# EAGLE design slo (EAGLE 9.6.2)
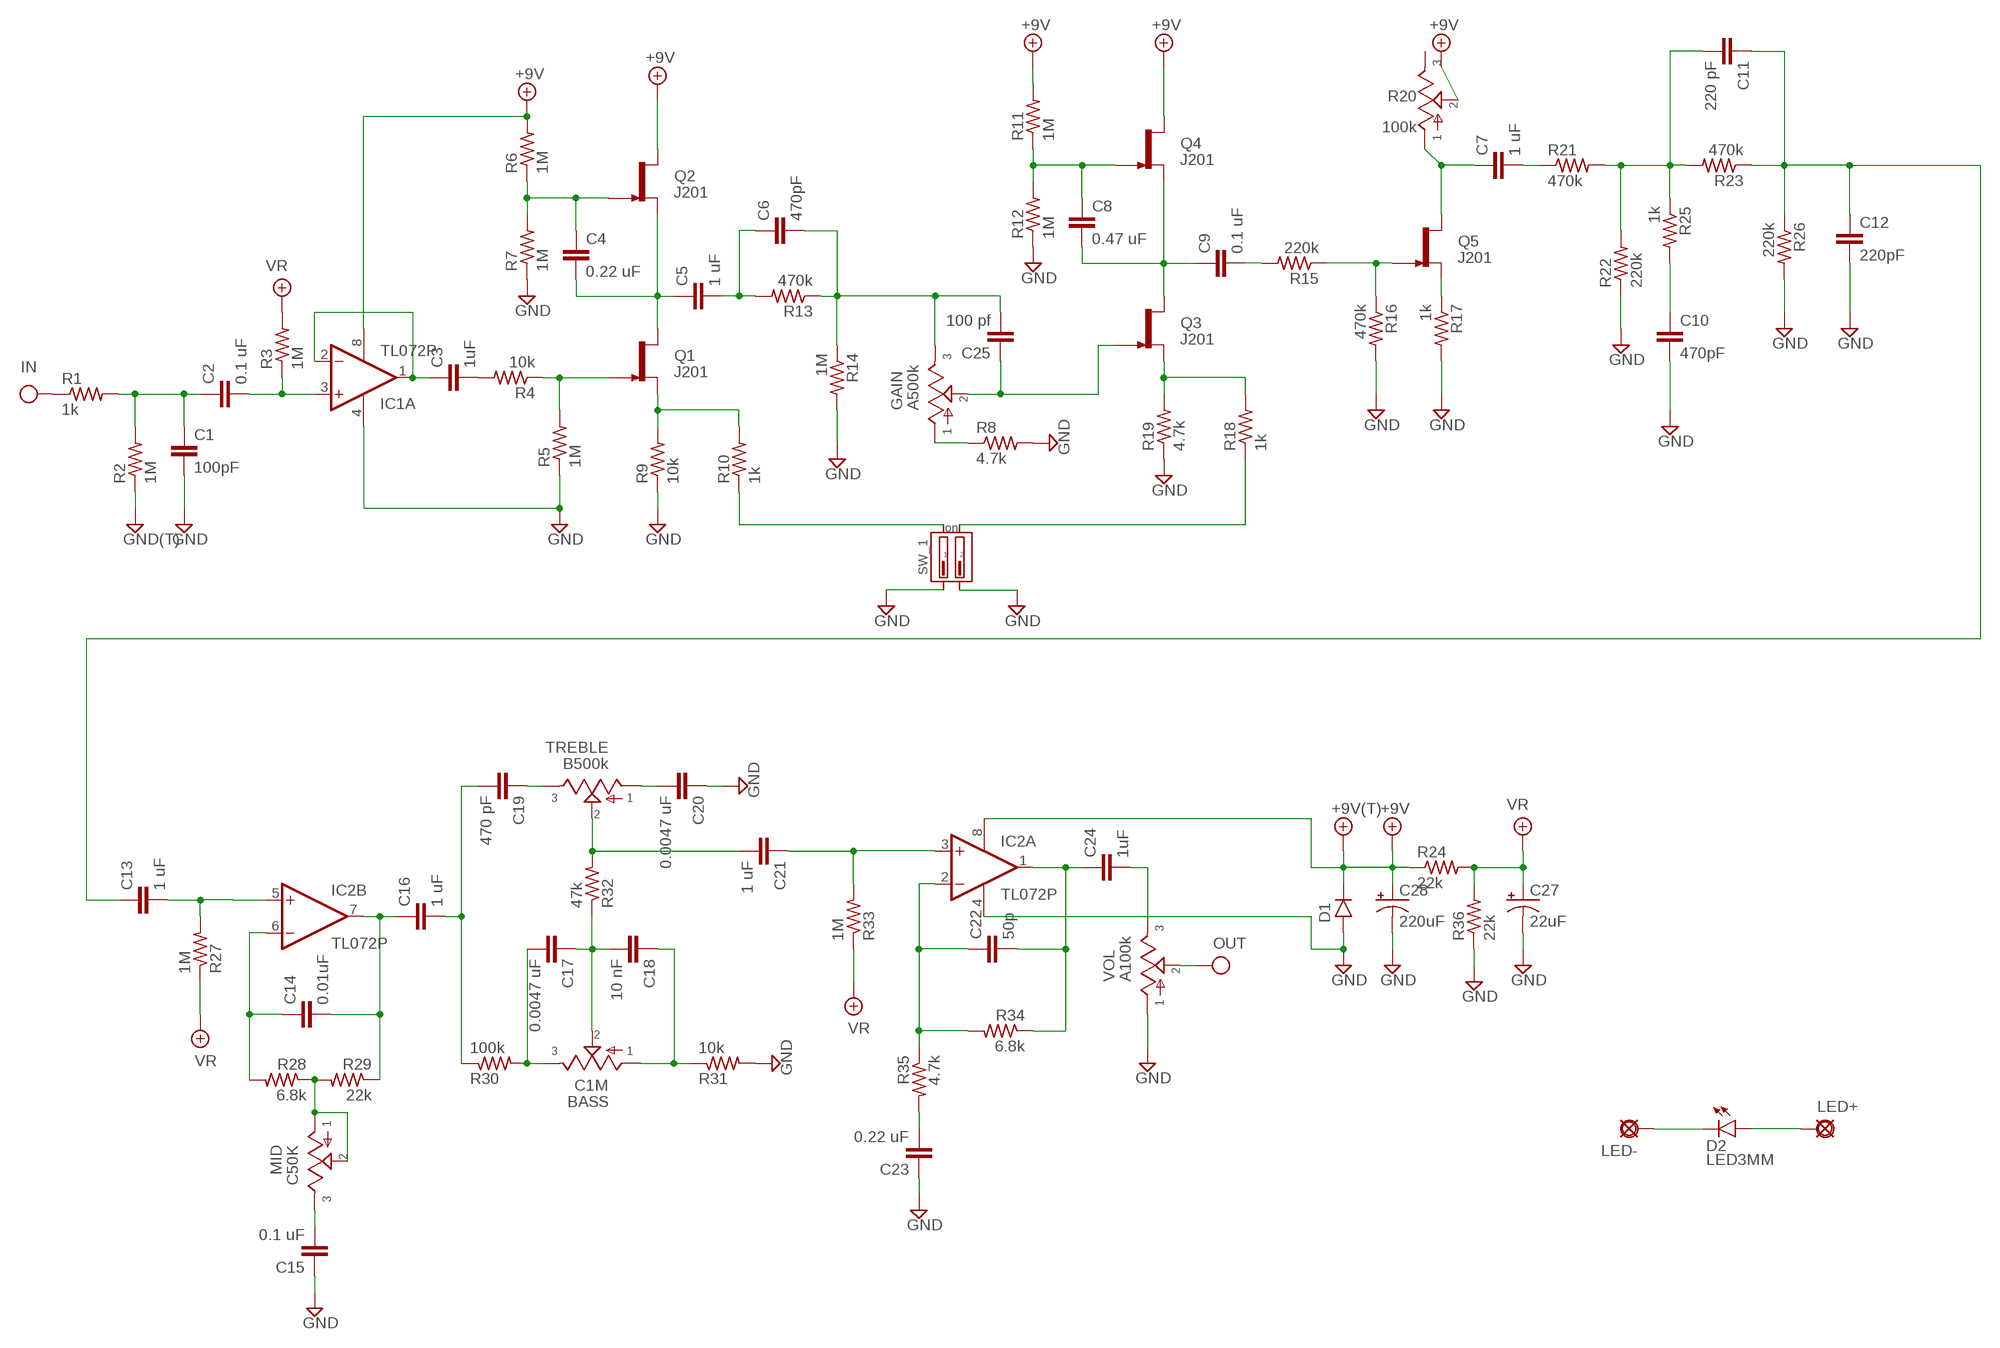
[diagram p0: schematic, sheet 1]

## Parts
+9V  +9V(T)  [SQUARE]
BASS  C1M  POT16MM  [16MM]
C1  100pF  050X030_0502  [050X030_050]
C2  0.1 uF  080X0452  [080X045]
C3  1uF  080X0502  [080X050]
C4  0.22 uF  080X0452  [080X045]
C5  1 uF  070X0302  [070X030]
C6  470pF  050X030_0502  [050X030_050]
C7  1 uF  080X0502  [080X050]
C8  0.47 uF  080X0452  [080X045]
C9  0.1 uF  080X0452  [080X045]
C10  470pF  070X0302  [070X030]
C11  220 pF  075X0353  [075X035_3]
C12  220pF  075X0353  [075X035_3]
C13  1 uF  080X0502  [080X050]
C14  0.01uF  050X030_0501  [050X030_050_1]
C15  0.1 uF  080X0453  [075X040_3]
C16  1 uF  080X0502  [080X050]
C17  0.0047 uF  075X0352  [075X035]
C18  10 nF  075X0352  [075X035]
C19  470 pF  075X0302  [075X030]
C20  0.0047 uF  075X0352  [075X035]
C21  1 uF  080X0502  [080X050]
C22  50p  050X030_0501  [050X030_050_1]
C23  0.22 uF  080X0452  [080X045]
C24  1uF  080X0502  [080X050]
C25  100 pf  050X030_0501  [050X030_050_1]
C27  22uF  050  [050_020]
C28  220uF  0631  [063_025]
D1  1N400X.1  [DO41-1]
D2  LED3MM  [LED3MM]
GAIN  A500k  POT16MM  [16MM]
GND  GND(T)  [SQUARE]
IC1  TL072P  [DIL08]
IC2  TL072P  [DIL08]
IN  IN(T)  [SQUARE]
LED+  PADO  [ROUND]
LED-  PAD  [SQUARE]
MID  C50K  POT16MM  [16MM]
OUT  OUT(T)  [SQUARE]
Q1  J201  [TO92-]
Q2  J201  [TO92-]
Q3  J201  [TO92-]
Q4  J201  [TO92-]
Q5  J201  [TO92-]
R1  1k  3MM.2  [R0204/2]
R2  1M  3MM.2  [R0204/2]
R3  1M  3MM.2  [R0204/2]
R4  10k  3MM.2  [R0204/2]
R5  1M  3MM.2  [R0204/2]
R6  1M  3MM.2  [R0204/2]
R7  1M  3MM.2  [R0204/2]
R8  4.7k  3MM.2  [R0204/2]
R9  10k  3MM.2  [R0204/2]
R10  1k  3MM.2  [R0204/2]
R11  1M  3MM.2  [R0204/2]
R12  1M  3MM.2  [R0204/2]
R13  470k  3MM.2  [R0204/2]
R14  1M  3MM.2  [R0204/2]
R15  220k  3MM.2  [R0204/2]
R16  470k  3MM.2  [R0204/2]
R17  1k  3MM.2  [R0204/2]
R18  1k  3MM.2  [R0204/2]
R19  4.7k  3MM.2  [R0204/2]
R20  100k  POTTRIM  [B25P]
R21  470k  3MM.2  [R0204/2]
R22  220k  3MM.2  [R0204/2]
R23  470k  3MM.2  [R0204/2]
R24  22k  3MM.2  [R0204/2]
R25  1k  3MM.2  [R0204/2]
R26  220k  3MM.2  [R0204/2]
R27  1M  3MM.2  [R0204/2]
R28  6.8k  3MM.2  [R0204/2]
R29  22k  3MM.2  [R0204/2]
R30  100k  3MM.2  [R0204/2]
R31  10k  3MM.2  [R0204/2]
R32  47k  3MM.2  [R0204/2]
R33  1M  3MM.2  [R0204/2]
R34  6.8k  3MM.2  [R0204/2]
R35  4.7k  3MM.2  [R0204/2]
R36  22k  3MM.2  [R0204/2]
SW_1  DIP2  [DIP2.B]
TREBLE  B500k  POT16MM  [16MM]
VOL  A100k  POT16MM  [16MM]

## Nets
+9V: +9V.1(+9V) C28.+ D1.C IC1.8(P:V+) IC2.8(P:V+) Q2.3(D) Q4.3(D) R6.2 R11.2 R20.2 R24.1
GND: C1.2 C10.2 C12.2 C15.1 C20.1 C23.1 C27.- C28.- D1.A GND.1(GND) IC1.4(P:V-) IC2.4(P:V-) R2.1 R5.1 R7.1 R8.2 R9.1 R12.1 R14.2 R16.2 R17.2 R19.1 R22.1 R26.2 R31.2 R36.1 SW_1.P$1 SW_1.P$3 VOL.1
IN: IN.1(IN) R1.1
N$1: C1.1 C2.1 R1.2 R2.2
N$2: C2.2 IC1.3(A:+IN) R3.1
N$3: C3.1 IC1.1(A:OUT) IC1.2(A:-IN)
N$4: C25.1 GAIN.2 Q3.1(G)
N$5: C3.2 R4.2
N$6: Q1.1(G) R4.1 R5.2
N$7: Q1.2(S) R9.2 R10.2
N$8: C5.2 C6.1 R13.2
N$9: Q5.1(G) R15.1 R16.1
N$10: C6.2 C25.2 GAIN.3 R13.1 R14.1
N$11: C10.1 R25.2
N$12: Q3.2(S) R18.2 R19.2
N$13: C4.2 C5.1 Q1.3(D) Q2.2(S)
N$14: GAIN.1 R8.1
N$15: C8.2 C9.1 Q3.3(D) Q4.2(S)
N$16: C4.1 Q2.1(G) R6.1 R7.2
N$17: C8.1 Q4.1(G) R11.1 R12.2
N$18: C9.2 R15.2
N$19: Q5.2(S) R17.1
N$20: C7.1 Q5.3(D) R20.1
N$21: C7.2 R21.1
N$22: C14.2 C16.1 IC2.7(B:OUT) R29.1
N$23: MID.1 MID.2 R28.1 R29.2
N$24: C14.1 IC2.6(B:-IN) R28.2
N$25: C16.2 C19.2 R30.1
N$26: C15.2 MID.3
N$27: C11.1 C12.1 C13.1 R23.1 R26.1
N$28: BASS.3 C17.2 R30.2
N$29: D2.K(C) LED-.1(PAD)
N$30: C13.2 IC2.5(B:+IN) R27.2
N$31: BASS.1 C18.1 R31.1
N$32: C11.2 R21.2 R22.2 R23.2 R25.1
N$33: BASS.2 C17.1 C18.2 R32.1
N$34: C19.1 TREBLE.3
N$35: C21.2 R32.2 TREBLE.2
N$36: C20.2 TREBLE.1
N$37: C21.1 IC2.3(A:+IN) R33.2
N$38: D2.A LED+.1(PAD)
N$39: C22.1 IC2.2(A:-IN) R34.2 R35.1
N$40: C22.2 C24.1 IC2.1(A:OUT) R34.1
N$41: C23.2 R35.2
N$42: R18.1 SW_1.P$4
N$43: C24.2 VOL.3
N$44: R10.1 SW_1.P$2
OUT: OUT.1(OUT) VOL.2
VR: C27.+ R3.2 R24.2 R27.1 R33.1 R36.2
Unconnected: IC1.5(B:+IN) IC1.6(B:-IN) IC1.7(B:OUT) R20.3

## Library data of the parts
+9V = gm-supply:+9V(T): +9V Voltage Supply use this to hook up +9v throughout a schematic instead of running wire automatically labels the net "+9v" adds a hookup pad to the circuit board
BASS GAIN MID R20 TREBLE VOL = gm-pots:POT: Potentiometers the arrow indicates the clockwise motion of th wiper (lug 2) fully counter clockwise there is no resistance between lugs 1 and 2 fully clockwise the resistance between lugs 1 and 2 is the value of the pot
C1 C6 C14 C22 C25 = gm-caps-ceramic:050X030_050: 120 - 150pF Xicon Ceramic Disc 5mm lead spacing
C2 C4 C8 C9 C15 C23 = gm-caps-film-chicklet:080X045: 0.056 - 0.082uF Panasonic ECQ-B 8mm x 4.5mm 50V: 0.056 - 0.082uF;
C3 C7 C13 C16 C21 C24 = gm-caps-film-chicklet:080X050: 0.1uF Panasonic ECQ-B 8mm x 5mm
C5 C10 = gm-caps-film-chicklet:070X030: 0.0001 - .01uF (100 - 10,000pF) Panasonic ECQ-B 7mm x 3mm 50 or 63V: 0.0001 - .01uF (100 - 10,000pF);
C11 C12 C17 C18 C20 = gm-caps-film-chicklet:075X035: 0.027 - 0.033uF Panasonic ECQ-B 7mm x 4mm 50 or 63V: 0.027 - 0.033uF;
C19 = gm-caps-film-chicklet:075X030: 0.015 - 0.022uF Panasonic ECQ-B 7.5mm x 3mm 50 or 63V: 0.015 - 0.022uF;
C27 = gm-caps-electro-pol:050: 0.22 - 100uF Xicon values at Mouser.com: 10V: 10 - 100uF; 16V: 2.2 - 47uF; 25V: 0.47 - 47uF; 50V: 0.22 - 22uF
C28 = gm-caps-electro-pol:063: 33 - 220uF Xicon values at Mouser.com 10V: 220uF; 16V: 100uF; 25V: 100uF; 50V: 33uF
D1 = gm-diodes:1N400X: Rectifier Diodes often used in power supply to prevent damage from reverse polarization
D2 = gm-diodes:LED
GND = gm-supply:GND(T): Ground use this to hook up ground (GND) throughout a schematic instead of running wire automatically labels the net "GND" adds a hookup pad to the circuit board (you can use several)
IC1 IC2 = gm-ics:TL072: OP AMP
IN = gm-supply:IN(T): Input obsolete: use Pad instead and label net shematic input label with circuit board terminal/pad generally used only once on a schematic (because this device labels the net "IN" in the same way as a voltage supply or ground net); SPICEPREFIX: I
LED+ LED- = gm-supply:PAD: PAD use this package for pads with any purpose, including input, output, send or return various pad shapes: round, square, octogonal, long, and long offset
OUT = gm-supply:OUT(T): Output obsolete: use Pad instead and label net output label with circuit board terminal/pad usually appears only once on a schematic
Q1-Q5 = gm-trans:J201: N-channel JFET
R1-R19 R21-R36 = gm-resistors:3MM: 3mm Resistors Leads spaced 1-6 holes apart for 0.1" perfboard. Suitable for 1/8 watt resistors.
SW_1 = switches:DIP2: DIP 2-position

## Board
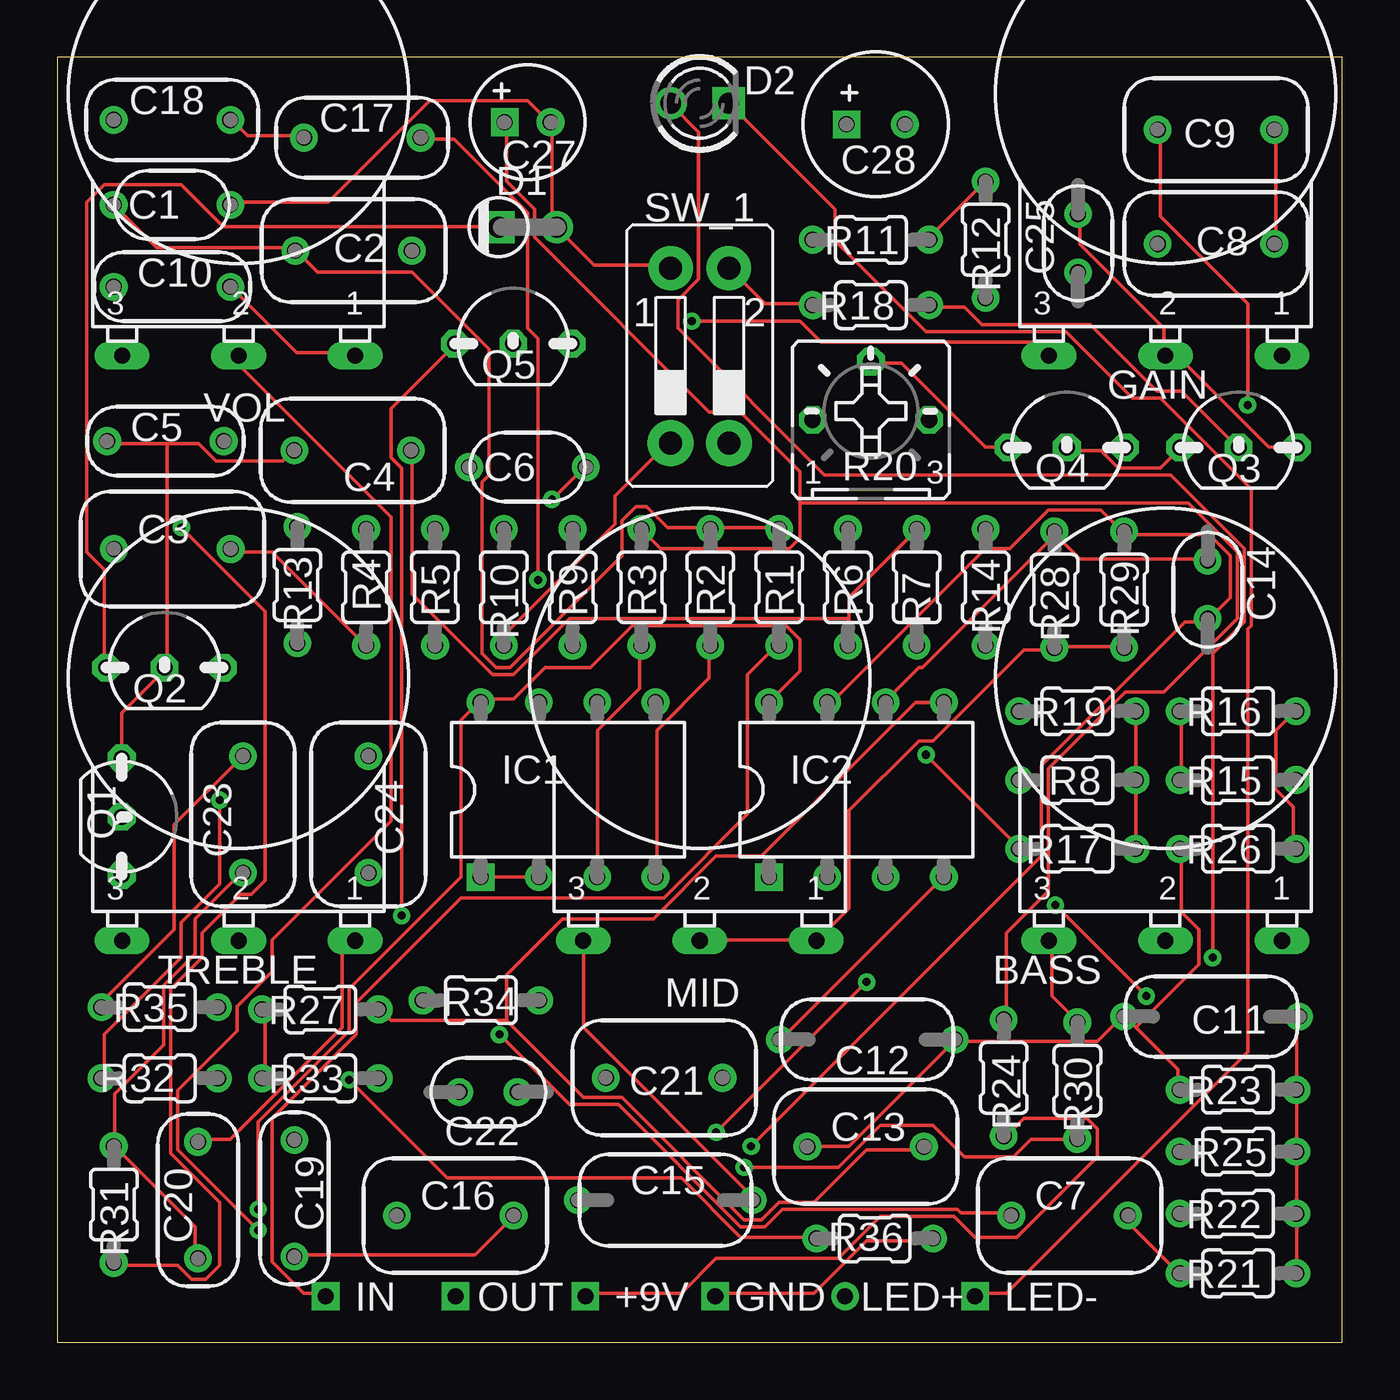
[diagram p1: board, top side]
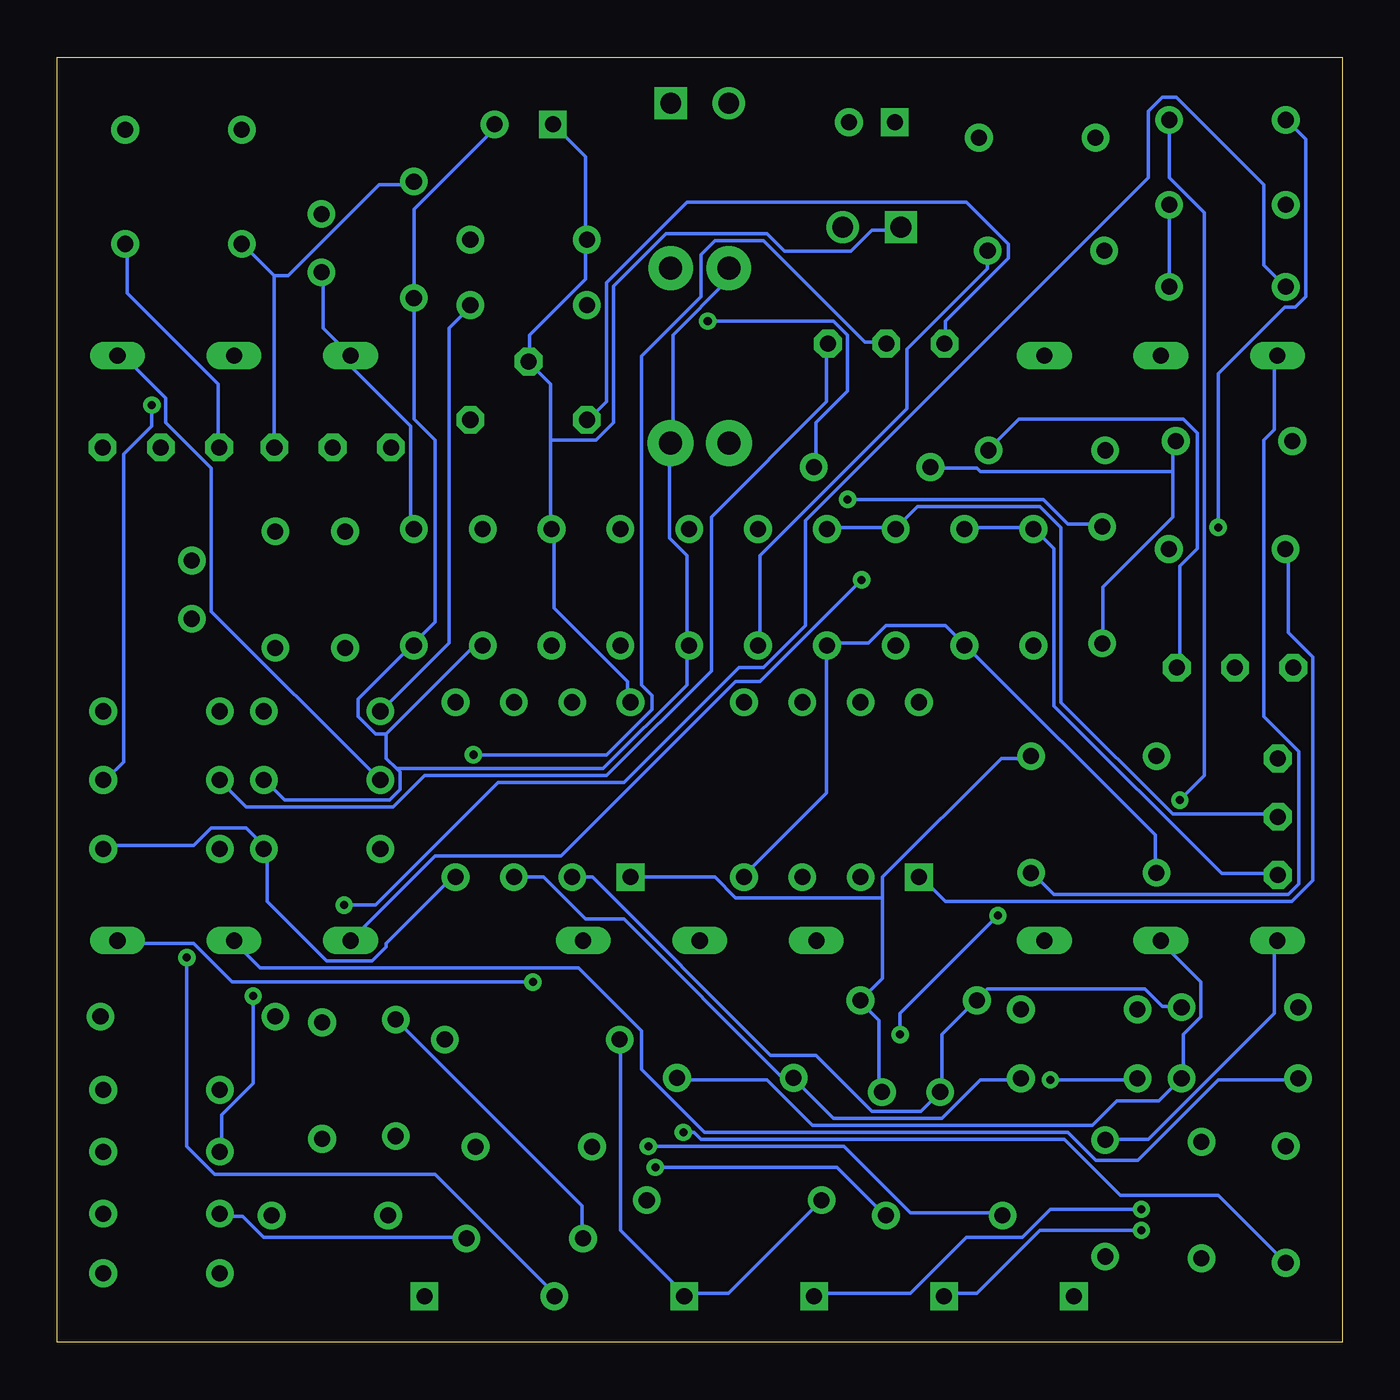
[diagram p2: board, bottom side, seen from below]

Size 56 x 56 mm. Coordinates in mm from the lower left corner, seen from the top.
Outline: 0,0 56,0 56,56 0,56 0,0
Copper layers (1*16): Top 0.035mm / dielectric 1.5mm / Bottom 0.035mm
Design rules "default": minimum track width 6mil, minimum drill 0.35mm, track to track 6mil, track to pad 6mil, pad to pad 6mil, via to via 6mil, smd to smd 6mil, copper to edge 40mil, drill to drill 6mil, minimum pad ring 10mil, minimum via ring 8mil, stop-mask expansion 4mil, vias tented up to drill 0mil, thermal gap 10mil

### Footprints (pad centres in the part's own frame; a part is rotated, then mirrored left to right if it is on the bottom)
SQUARE = drill 0.7 square: 1 0,0
16MM = drill 0.7 long: 1 5.08,0; 2 0,0; 3 -5.08,0
050X030_050 = drill 0.7: 1 -2.54,0; 2 2.54,0
080X045 = drill 0.7: 1 -2.54,0; 2 2.54,0
080X050 = drill 0.7: 1 -2.54,0; 2 2.54,0
070X030 = drill 0.7: 1 -2.54,0; 2 2.54,0
075X035_3 = drill 0.7: 1 -3.81,0; 2 3.81,0
050X030_050_1 = drill 0.7: 1 -1.27,0; 2 1.27,0
075X040_3 = drill 0.7: 1 -3.81,0; 2 3.81,0
075X035 = drill 0.7: 1 -2.54,0; 2 2.54,0
075X030 = drill 0.7: 1 -2.54,0; 2 2.54,0
050_020 = drill 0.7 square: + -1,0 | drill 0.7: - 1,0
063_025 = drill 0.7 square: + -1.27,0 | drill 0.7: - 1.27,0
DO41-1 = drill 0.9: A 1.27,0 | drill 0.9 square: C -1.27,0
LED3MM = drill 0.9: A -1.27,0 | drill 0.9 square: K 1.27,0
DIL08 = drill 0.7 square: 1 -3.81,-3.81 | drill 0.7: 2 -1.27,-3.81; 3 1.27,-3.81; 4 3.81,-3.81; 5 3.81,3.81; 6 1.27,3.81; 7 -1.27,3.81; 8 -3.81,3.81
ROUND = drill 0.7: 1 0,0
TO92- = drill 0.7 octagon: 1 2.54,0; 2 0,0; 3 -2.54,0
R0204/2 = drill 0.7: 1 -2.54,0; 2 2.54,0
B25P = drill 0.7 octagon: 1 -2.54,0; 2 0,2.54; 3 2.54,0
DIP2.B = drill 1 pad 1.93: P$1 -1.27,3.81; P$4 1.27,3.81 | drill 1 pad 2: P$2 -1.27,-3.81; P$3 1.27,-3.81

### Placement (x,y rotation side)
+9V  23.01,2 0 top
BASS  48.3,17.5 0 top
C1  5,49.57 0 top
C2  12.91,47.57 0 top
C3  5.01,34.57 0 top
C4  12.87,38.87 180 top
C5  4.71,39.27 0 top
C6  20.49,38.14 0 top
C7  44.12,5.52 0 top
C8  50.5,47.87 0 top
C9  50.5,52.85 180 top
C10  5,46 0 top
C11  50.31,14.19 0 top
C12  35.3,13.19 180 top
C13  35.23,8.52 0 top
C14  50.14,32.8 270 top
C15  26.5,6.19 0 top
C16  17.34,5.52 0 top
C17  13.29,52.5 0 top
C18  5,53.27 0 top
C19  10.33,6.27 270 top
C20  6.13,6.19 90 top
C21  26.45,11.52 0 top
C22  18.79,10.9 0 top
C23  8.09,23 90 top
C24  13.56,23 270 top
C25  44.49,47.9 270 top
C27  20.5,53.17 0 top
C28  35.67,53.08 0 top
D1  20.5,48.6 0 top
D2  28,54 0 top
GAIN  48.3,43 0 top
GND  28.68,2 0 top
IC1  22.26,24.08 0 top
IC2  34.83,24.08 0 top
IN  11.69,2 0 top
LED+  34.34,2 0 top
LED-  40,2 0 top
MID  28,17.5 0 top
OUT  17.35,2 0 top
Q1  2.8,22.9 270 top
Q2  4.67,29.4 0 top
Q3  51.49,39 0 top
Q4  44,39 0 top
Q5  19.87,43.52 0 top
R1  31.46,32.9 90 top
R2  28.46,32.9 90 top
R3  25.46,32.9 90 top
R4  13.46,32.9 270 top
R5  16.46,32.9 90 top
R6  34.46,32.9 90 top
R7  37.46,32.9 90 top
R8  44.46,24.5 0 top
R9  22.46,32.9 90 top
R10  19.46,32.9 90 top
R11  35.46,48.05 180 top
R12  40.46,48.05 90 top
R13  10.46,33 270 top
R14  40.46,32.9 270 top
R15  51.46,24.5 0 top
R16  51.46,27.5 0 top
R17  44.46,21.5 0 top
R18  35.46,45.2 0 top
R19  44.46,27.5 180 top
R20  35.46,40.2 0 top
R21  51.46,3 0 top
R22  51.46,5.6 0 top
R23  51.46,11 0 top
R24  41.25,11.52 90 top
R25  51.46,8.3 180 top
R26  51.46,21.5 0 top
R27  11.46,14.5 0 top
R28  43.46,32.8 90 top
R29  46.5,32.8 270 top
R30  44.46,11.4 90 top
R31  2.46,6 90 top
R32  4.46,11.5 0 top
R33  11.46,11.5 0 top
R34  18.46,14.9 180 top
R35  4.46,14.6 180 top
R36  35.63,4.52 180 top
SW_1  28,43 0 top
TREBLE  7.9,17.5 0 top
VOL  7.9,43 0 top

### Tracks (layer width: path | path; a pad name or v marks a point on that pad's centre or on a via)
+9V  (via drill 0.35)
  Top 0.152: Q2.3 2.05,29.41 2.05,33.68 1.29,34.44 1.29,49.68 2.05,50.44 5.4,50.44 7.23,48.62 19.12,48.62 D1.C | +9V.1 23.08,2.13 27.19,2.13 28.72,3.66 34.05,3.66 35.88,5.49 39.08,5.49 40,4.57 41.82,4.57 45.33,8.08 45.33,9.3 44.87,9.75 42.13,9.75 41.37,8.99 R24.1 | IC2.8 31.16,28.04 32.38,29.26 32.38,30.63 31.77,31.24 25.06,31.24 23.23,29.41 21.25,29.41 19.88,28.04 18.51,28.04 IC1.8 18.36,27.89 17.59,27.13 17.59,20.27 12.72,15.39 12.72,13.56 8.75,9.6 v8.75,5.79 | Q4.3 41.37,39.01 40.45,39.01 36.8,42.67 35.58,42.67 R20.2
  Bottom 0.152: C28.+ 34.36,53.03 32.98,51.66 32.98,48.16 R11.2 32.98,48.01 32.98,46.33 35.42,43.89 35.42,42.82 R20.2 35.42,42.67 34.51,41.76 34.51,39.32 | 34.51,39.32 34.51,35.51 R6.2 34.36,35.36 34.36,32 31.16,28.8 31.16,28.04 IC2.8 | v8.75,5.79 12.72,5.79 13.94,4.57 16.37,4.57 18.81,2.13 22.93,2.13 +9V.1 | 34.51,39.32 32.53,39.32 31.77,40.08 31.77,46.02 29.48,48.31 25.06,48.31 24.3,47.55 21.4,47.55 20.49,48.46 19.27,48.46 D1.C
GND
  Top 0.152: C20.1 6.01,3.66 6.01,5.03 2.5,8.53 R31.2 2.5,8.69 2.5,10.82 4.64,12.95 4.64,15.54 6.01,16.92 6.01,18.44 7.99,20.42 C23.1 | IC1.4 26.13,20.42 26.13,26.67 28.41,28.96 28.41,30.33 R2.1 | VOL.1 12.87,43.13 10.43,43.13 7.69,45.87 C10.2 | SW_1.P$1 26.58,46.94 23.38,46.94 21.86,48.46 D1.A 21.71,48.62 21.55,48.77 21.55,53.03 C27.- 21.4,53.19 20.49,54.1 16.22,54.1 11.8,49.68 7.69,49.68 C1.2 | C12.2 31.61,13.26 38.62,20.27 IC2.4 | R36.1 38.17,4.42 35.27,4.42 32.98,2.13 28.72,2.13 GND.1 | R26.2 53.86,21.64 53.86,23.32 53.1,24.08 53.1,26.67 53.86,27.43 R16.2 | R17.2 47.01,21.64 47.01,24.38 R8.2 47.01,24.54 47.01,27.43 R19.1
  Bottom 0.152: C23.1 8.14,20.57 8.14,22.1 16.37,30.33 R5.1 16.53,30.48 17.29,31.24 19.88,31.24 20.64,30.48 22.32,30.48 R9.1 22.47,30.33 22.47,23.93 25.98,20.42 IC1.4 | C1.2 7.53,49.53 7.53,46.02 C10.2 | SW_1.P$1 26.74,46.79 26.74,46.33 29.18,43.89 29.18,39.32 SW_1.P$3 29.33,39.17 29.33,35.05 28.57,34.29 28.57,30.48 R2.1 28.57,30.33 28.57,28.65 32.22,24.99 41.22,24.99 | C15.1 22.77,6.1 26.74,2.13 28.57,2.13 GND.1 28.72,2.13 31.46,4.88 31.46,13.11 C12.2 | R22.1 48.84,5.49 47.92,5.49 47.01,4.57 38.32,4.57 R36.1 | C28.- 36.8,53.03 40.45,49.38 40.45,45.57 R12.1 40.45,45.41 40.45,40.23 39.54,39.32 39.54,31.39 40.45,30.48 R14.2 40.6,30.33 42.89,28.04 42.89,27.28 42.13,26.52 41.67,26.52 | 41.67,26.52 37.86,30.33 37.56,30.33 R7.1 | 41.67,26.52 41.67,25.45 41.22,24.99 | 41.22,24.99 41.06,24.84 41.06,24.08 41.52,23.62 46.09,23.62 46.85,24.38 R8.2 | R26.2 53.86,21.64 50.05,21.64 49.29,22.4 47.77,22.4 47.01,21.64 R17.2 46.85,21.49 46.85,19.2 44.26,16.61 42.28,16.61 41.67,17.22 41.67,17.37 38.78,20.27 IC2.4
IN
  Top 0.152: IN.1 11.65,2.13 10.73,2.13 9.36,3.5 9.36,9.75 13.02,13.41 13.02,14.78 17.59,19.36 26.43,19.36 30.09,23.01 30.09,29.11 31.31,30.33 R1.1
N$1
  Top 0.152: R1.2 31.31,35.51 28.57,35.51 R2.2 28.41,35.51 26.58,35.51 25.67,36.42 25.21,36.42 24.6,35.81 24.6,34.29 19.73,29.41 19.12,29.41 18.51,30.02 18.51,37.49 18.81,37.8 18.81,43.28 15.46,46.63 11.34,46.63 10.43,47.55 C2.1 10.28,47.7 4.33,47.7 2.5,49.53 C1.1
N$2
  Top 0.152: IC1.3 23.54,20.42 23.54,26.67 25.36,28.5 25.36,30.33 R3.1
  Bottom 0.152: C2.2 15.46,47.55 15.46,46.79 18.96,43.28 18.96,40.69 25.36,34.29 25.36,30.48 R3.1
N$3
  Top 0.152: IC1.2 20.95,20.27 18.51,20.27 IC1.1
  Bottom 0.152: C3.1 2.35,34.44 2.35,30.94 1.29,29.87 1.29,20.12 2.2,19.2 17.29,19.2 18.36,20.27 IC1.1
N$4
  Top 0.152: C25.1 44.57,49.07 44.57,47.85 48.23,44.2 48.23,43.13 GAIN.2 48.38,42.98 48.84,42.98 52.8,39.01 54.02,39.01 Q3.1
N$5
  Top 0.152: C3.2 7.69,34.44 9.36,34.44 13.33,30.48 R4.2
N$6
  Bottom 0.152: Q1.1 2.81,20.42 5.25,20.42 12.56,27.74 12.56,34.59 13.33,35.36 R4.1 13.48,35.51 16.37,35.51 R5.2
N$7
  Bottom 0.152: Q1.2 2.81,23.01 7.38,23.01 12.26,27.89 12.26,35.51 13.17,36.42 18.51,36.42 19.42,35.51 R10.2 19.57,35.51 22.32,35.51 R9.2
N$8
  Bottom 0.152: 7.38,37.95 7.38,35.97 10.43,32.92 10.43,30.48 R13.2 | 7.38,37.95 7.38,39.17 C5.2 | 7.38,37.95 15.76,37.95 15.92,38.1 17.9,38.1 C6.1
N$9
  Top 0.152: R15.1 48.99,24.54 48.99,27.43 R16.1
  Bottom 0.152: Q5.1 22.47,43.43 22.47,41 27.5,35.97 27.5,29.26 32.07,24.69 40,24.69 41.37,23.32 47.77,23.32 48.84,24.38 R15.1
N$10  (via drill 0.35)
  Top 0.152: v21.55,36.73 22.93,38.1 C6.2 | v27.65,44.5 32.38,44.5 33.29,43.59 42.74,43.59 43.2,43.13 GAIN.3
  Bottom 0.152: v21.55,36.73 13.02,36.73 11.95,35.66 10.58,35.66 R13.1 | R14.1 40.6,35.51 40.6,39.93 43.2,42.52 43.2,42.98 GAIN.3 43.35,43.13 44.41,44.2 44.41,46.48 C25.2 | v27.65,44.5 22.16,44.5 21.55,43.89 21.55,41.45 22.93,40.08 22.93,38.25 C6.2
N$11  (via drill 0.35)
  Top 0.152: v43.5,19.05 v47.46,15.09
  Bottom 0.152: v47.46,15.09 47.46,11.28 48.84,9.91 48.84,8.38 R25.2 | v43.5,19.05 42.13,19.05 36.8,24.38 31.31,24.38 26.28,29.41 25.21,29.41 23.38,31.24 23.38,35.81 8.45,50.75 8.45,53.65 7.84,54.25 7.23,54.25 3.42,50.44 3.42,46.94 2.5,46.02 C10.1
N$12
  Top 0.152: R18.2 38.01,45.11 39.54,45.11 40.3,44.35 45.02,44.35 47.92,41.45 48.99,41.45 51.43,39.01 Q3.2
  Bottom 0.152: R19.2 41.82,27.58 38.93,30.48 38.93,44.2 38.01,45.11 R18.2
N$13
  Top 0.152: Q1.3 2.81,25.45 2.81,27.43 4.64,29.26 Q2.2 4.79,29.41 4.79,39.17 | 4.79,39.17 6.16,39.17 6.92,38.41 9.82,38.41 10.28,38.86 C4.2 | 4.79,39.17 2.2,39.17 C5.1
N$14
  Bottom 0.152: R8.1 41.98,24.54 49.29,31.85 49.29,38.1 51.27,40.08 51.27,41.15 53.25,43.13 GAIN.1
N$15
  Top 0.152: Q4.2 44.11,38.86 45.48,38.86 46.24,38.1 48.07,38.1 48.84,38.86 Q3.3 | C8.2 53.1,48.01 53.1,52.73 C9.1
  Bottom 0.152: Q3.3 48.99,39.01 48.99,41.76 52.95,45.72 52.95,47.85 C8.2
N$16
  Top 0.152: 34.51,31.55 34.51,32.46 37.41,35.36 R7.2 | 34.51,31.55 34.51,30.48 R6.1 | 34.51,31.55 22.32,31.55 19.88,29.11 18.96,29.11 15.46,32.61 15.46,38.86 C4.1
  Bottom 0.152: Q2.1 7.08,29.41 7.08,33.83 6.32,34.59 6.32,39.62 6.92,40.23 14.09,40.23 15.31,39.01 C4.1
N$17
  Top 0.152: R11.1 38.01,48.16 R12.2
  Bottom 0.152: 46.55,46.48 46.55,39.01 Q4.1 | 46.55,46.48 47.92,47.85 C8.1 | 46.55,46.48 45.94,46.48 41.98,50.44 40.6,50.44 R12.2
N$18  (via drill 0.35)
  Top 0.152: v51.88,40.84 51.88,45.26 48.07,49.07 48.07,52.73 C9.2
  Bottom 0.152: v51.88,40.84 51.88,39.93 53.1,38.71 53.1,25.3 53.86,24.54 R15.2
N$19  (via drill 0.35)
  Top 0.152: v37.86,25.6 41.82,21.64 R17.1
  Bottom 0.152: v37.86,25.6 32.07,25.6 30.09,27.58 30.09,28.19 30.55,28.65 30.55,42.98 27.96,45.57 27.96,47.4 27.35,48.01 25.21,48.01 20.79,43.59 19.88,43.59 Q5.2
N$20  (via drill 0.35)
  Top 0.152: v19.27,13.41 22.32,10.36 24.45,10.36 29.79,5.03 30.85,5.03 31.61,5.79 39.23,5.79 39.39,5.64 41.52,5.64 C7.1 | v15,18.59 15,38.1 14.54,38.56 14.54,40.69 17.29,43.43 Q5.3
  Bottom 0.152: Q5.3 17.29,43.59 17.29,44.5 14.54,47.24 14.54,47.85 16.37,49.68 28.57,49.68 32.07,46.18 32.07,41 32.83,40.23 R20.1 | v19.27,13.41 19.27,14.33 v15,18.59
N$21
  Top 0.152: C7.2 46.7,5.49 46.7,5.18 48.84,3.05 R21.1
N$22  (via drill 0.35)
  Top 0.152: IC2.7 33.59,28.04 33.9,28.04 40.45,34.59 41.52,34.59 43.2,36.27 45.48,36.27 46.4,35.36 R29.1 46.55,35.2 50.21,35.2 51.12,34.29 51.12,32.46 50.21,31.55 C14.2 50.05,31.39 49.14,31.39 42.89,25.15 42.89,21.18 v30.24,8.53
  Bottom 0.152: v30.24,8.53 21.71,8.53 18.81,5.64 14.85,5.64 C16.1
N$23
  Top 0.152: R29.2 46.4,30.33 43.5,30.33 R28.1 43.35,30.18 42.13,30.18 38.17,26.21 37.56,26.21 34.51,23.16 34.51,18.9 33.14,17.53 MID.1 32.98,17.53 28.11,17.53 MID.2
N$24
  Top 0.152: 43.5,35.2 37.71,29.41 37.56,29.41 36.19,28.04 IC2.6 | 43.5,35.2 44.57,34.14 50.05,34.14 C14.1 | 43.5,35.2 R28.2
N$25  (via drill 0.35)
  Top 0.152: C19.2 10.43,3.81 18.2,3.81 19.88,5.49 C16.2 | v29.94,7.62 34.05,7.62 35.88,9.45 38.17,9.45 39.54,8.08 41.67,8.08 42.43,8.84 44.41,8.84 R30.1
  Bottom 0.152: v29.94,7.62 22.01,7.62 20.03,5.64 C16.2
N$26
  Top 0.152: MID.3 22.93,17.37 22.93,13.72 30.39,6.25 C15.2
N$27
  Top 0.152: C13.1 32.83,8.53 34.51,8.53 39.08,13.11 C12.1 39.23,13.11 45.33,13.11 46.4,14.17 C11.1 46.55,14.17 47.01,13.72 | 47.01,13.72 48.84,11.89 48.84,11.12 R23.1 | 47.01,13.72 49.75,16.46 49.75,17.98 48.99,18.75 48.99,21.49 R26.1
N$28  (via drill 0.35)
  Top 0.152: BASS.3 43.35,17.37 43.35,15.09 44.41,14.02 R30.2 | v20.95,33.22 20.95,43.74 20.49,44.2 20.49,49.23 17.29,52.43 15.92,52.43 C17.2
  Bottom 0.152: v20.95,33.22 25.36,28.8 26.43,28.8 34.05,21.18 39.54,21.18 43.2,17.53 BASS.3
N$29
  Top 0.152: LED-.1 40.15,2.13 41.37,2.13 51.88,12.65 51.88,31.09 52.03,31.24 52.03,37.19 48.07,41.15 46.85,41.15 43.96,44.04 37.86,44.04 33.9,48.01 33.9,49.38 29.33,53.95 D2.K
N$30
  Top 0.152: 19.57,14.02 22.93,10.67 24.6,10.67 29.94,5.33 30.7,5.33 31.46,6.1 32.98,6.1 35.27,8.38 37.71,8.38 C13.2 | 19.57,14.02 14.54,14.02 14.09,14.48 R27.2 | 19.57,14.02 19.57,16 22.01,18.44 25.98,18.44 28.72,21.18 30.7,21.18 37.41,27.89 38.62,27.89 IC2.5
N$31  (via drill 0.35)
  Top 0.152: v5.4,35.51 9.06,31.85 9.06,20.12 8.45,19.51 7.99,19.51 6.32,17.83 6.32,16.76 4.94,15.39 4.94,8.23 7.08,6.1 7.08,3.35 6.47,2.74 5.86,2.74 5.25,3.35 2.5,3.35 R31.1 | v28.72,9.14 v35.27,15.7
  Bottom 0.152: v5.4,35.51 5.4,42.22 2.5,45.11 2.05,45.11 1.59,45.57 1.59,52.43 2.35,53.19 C18.1 | v35.27,15.7 48.38,15.7 50.05,17.37 53.25,17.37 BASS.1 | v28.72,9.14 28.26,9.14 27.96,8.84 12.11,8.84 9.67,6.4 5.4,6.4 R31.1
N$32
  Top 0.152: R21.2 54.02,3.05 54.02,5.49 R22.2 54.02,5.64 54.02,8.23 R25.1 54.02,8.38 54.02,10.97 R23.2 54.02,11.12 54.02,14.17 C11.2
N$33  (via drill 0.35)
  Top 0.152: C17.1 10.73,52.58 8.3,52.58 7.69,53.19 C18.2 | v7.08,23.62 7.08,19.96 5.4,18.29 5.4,16.76 2.05,13.41 2.05,11.58 R32.1
  Bottom 0.152: R32.1 2.05,11.43 5.4,11.43 8.91,7.92 10.73,7.92 11.95,9.14 27.8,9.14 30.55,11.89 30.55,13.56 33.29,16.31 47.16,16.31 48.23,17.37 BASS.2 | v7.08,23.62 6.01,24.69 6.01,49.23 7.53,50.75 7.53,53.19 C18.2
N$34
  Bottom 0.152: TREBLE.3 2.96,17.37 2.96,14.33 8.45,8.84 10.28,8.84 C19.1
N$35
  Bottom 0.152: TREBLE.2 7.84,17.37 6.16,15.7 6.16,14.17 6.92,13.41 6.92,11.58 R32.2 7.08,11.43 7.99,10.52 9.82,10.52 10.89,9.45 23.08,9.45 25.06,11.43 28.87,11.43 C21.2
N$36
  Top 0.152: C20.2 6.16,8.84 7.53,8.84 12.41,13.72 12.41,16.92 12.87,17.37 TREBLE.1
N$37
  Bottom 0.152: R33.2 14.09,11.43 15.76,11.43 17.44,9.75 22.16,9.75 23.84,11.43 C21.1 23.99,11.58 24.45,11.58 31.31,18.44 32.98,18.44 34.81,20.27 36.03,20.27 IC2.3
N$38  (via drill 0.35)
  Top 0.152: v50.36,16.76 50.36,30.02 51.73,31.39 51.73,34.59 48.53,37.8 33.44,37.8 27.04,44.2 27.04,45.41 27.96,46.33 27.96,52.73 26.74,53.95 D2.A
  Bottom 0.152: v50.36,16.76 50.36,8.53 49.14,7.32 39.54,7.32 34.36,2.13 LED+.1
N$39
  Bottom 0.152: R35.1 7.08,14.63 7.84,14.63 8.6,15.39 15.46,15.39 15.92,14.94 R34.2 16.07,14.78 17.44,13.41 17.44,10.97 C22.1 17.59,10.82 18.36,10.06 20.49,10.06 22.93,12.5 24.91,12.5 32.68,20.27 33.44,20.27 IC2.2
N$40
  Bottom 0.152: C22.2 20.18,10.97 20.18,14.02 20.95,14.78 R34.1 20.95,14.94 20.03,15.85 20.03,19.36 | 20.03,19.36 20.03,20.27 14.85,25.45 13.63,25.45 C24.1 | 20.03,19.36 26.43,19.36 27.35,20.27 31,20.27 IC2.1
N$41
  Top 0.152: R35.2 2.05,14.63 2.05,14.94 5.1,17.98 5.1,22.55 7.99,25.45 C23.2
N$42
  Top 0.152: R18.1 32.83,45.26 30.85,45.26 29.33,46.79 SW_1.P$4
N$43
  Bottom 0.152: VOL.3 2.96,42.98 2.96,39.78 3.42,39.32 3.42,27.28 1.9,25.76 1.9,19.96 2.35,19.51 12.56,19.51 13.48,20.42 C24.2
N$44
  Top 0.152: R10.1 19.57,30.48 19.57,30.94 24.3,35.66 24.3,36.88 26.58,39.17 SW_1.P$2
OUT  (via drill 0.35)
  Top 0.152: v8.75,4.88 5.25,8.38 5.25,10.97 7.84,13.56 7.84,14.63 9.36,16.15 9.36,17.53 14.54,22.71 14.54,35.97 7.99,42.52 7.99,42.98 VOL.2
  Bottom 0.152: v8.75,4.88 13.17,4.88 15.92,2.13 17.29,2.13 OUT.1
VR  (via drill 0.35)
  Top 0.152: 32.38,36.58 32.38,35.05 31.92,34.59 26.28,34.59 25.52,35.36 R3.2 | 32.38,36.58 32.38,37.95 29.79,40.54 28.41,40.54 20.79,48.16 20.79,49.38 19.57,50.6 19.57,53.03 C27.+ | R33.1 9.06,11.58 9.06,14.48 R27.1 | v12.72,11.43 16.98,7.16 27.19,7.16 29.79,4.57 32.98,4.57 R36.2 | 32.38,36.58 49.29,36.58 51.43,34.44 51.43,31.55 48.23,28.35 46.55,28.35 43.2,24.99 43.2,19.66 41.37,17.83 41.37,14.17 R24.2
  Bottom 0.152: R36.2 33.14,4.57 33.14,5.94 41.22,14.02 R24.2 | v12.72,11.43 9.06,11.43 R33.1